# Altium schematic sheet DDR3LChip.SchDoc
size A3; SheetNumber: 6; SheetTotal: 22
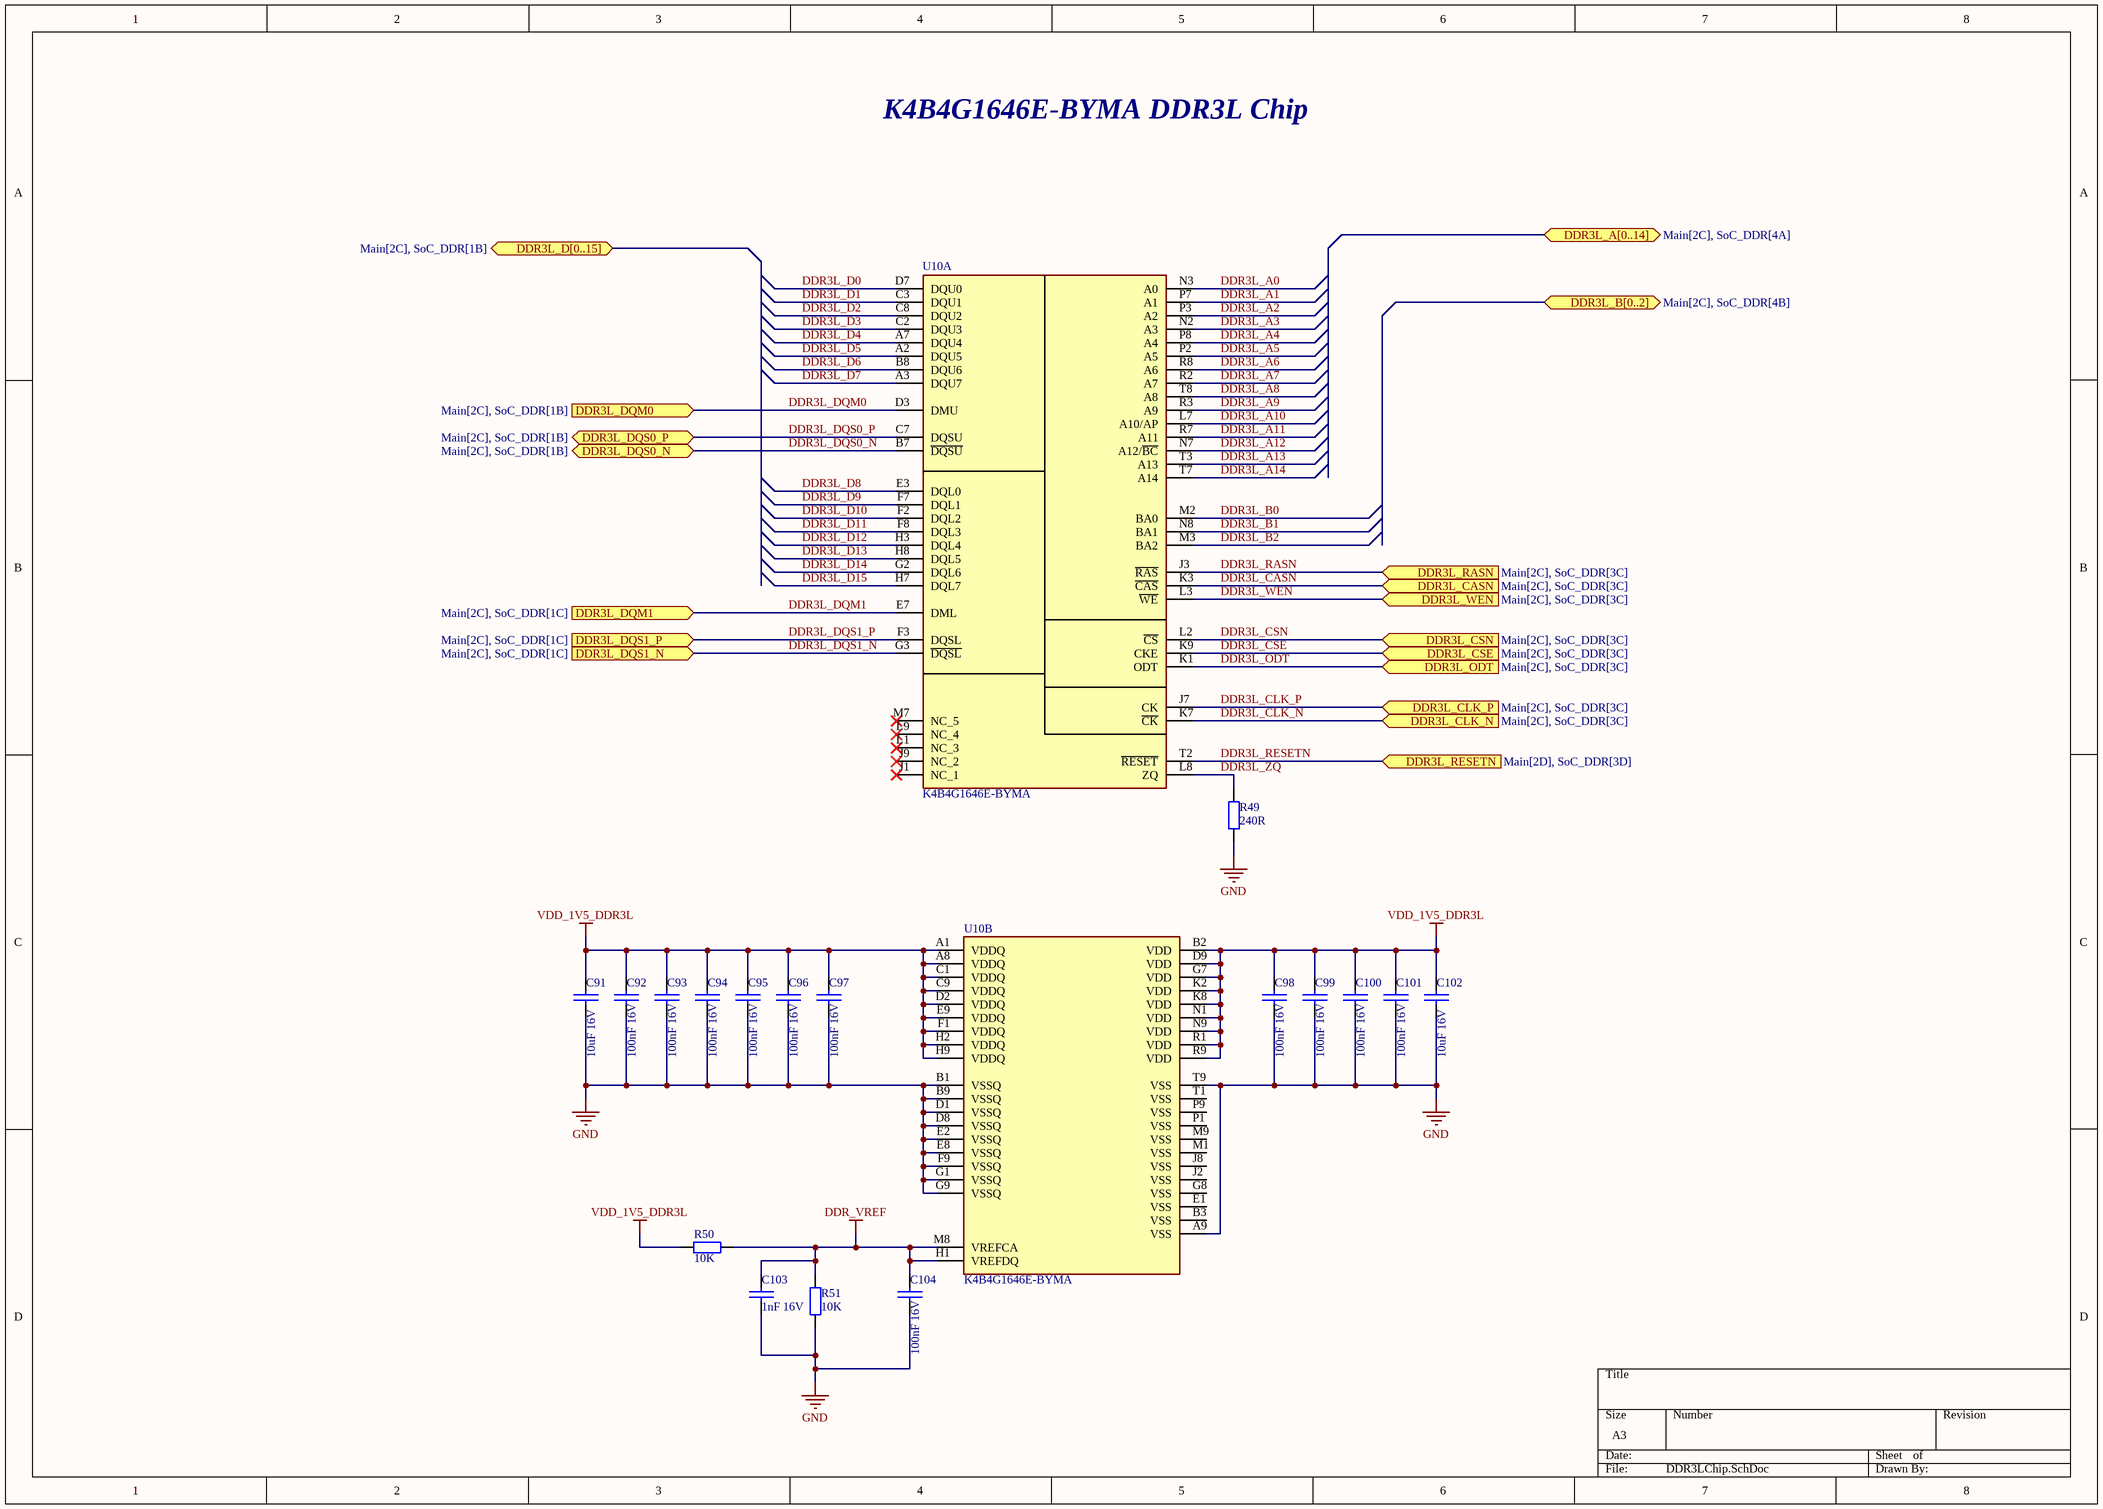
[diagram p0: DDR3LChip.SchDoc]

## Parts
C91  10uF 16V  [C_0603]
C92  100nF 16V  [C_0402]
C93  100nF 16V  [C_0402]
C94  100nF 16V  [C_0402]
C95  100nF 16V  [C_0402]
C96  100nF 16V  [C_0402]
C97  100nF 16V  [C_0402]
C98  100nF 16V  [C_0402]
C99  100nF 16V  [C_0402]
C100  100nF 16V  [C_0402]
C101  100nF 16V  [C_0402]
C102  10uF 16V  [C_0603]
C103  1nF 16V  [C_0402]
C104  100nF 16V  [C_0402]
R49  240R  [R_0402]
R50  10K  [R_0402]
R51  10K  [R_0402]
U10  K4B4G1646E-BYMA  [BGA96C80P9X16_750X1330X120]  (parts A,B of 2)

## Ports
DDR3L_A[0..14] (bidir, see Main[2C], SoC_DDR[4A]), DDR3L_B[0..2] (bidir, see Main[2C], SoC_DDR[4B]), DDR3L_CASN (in, see Main[2C], SoC_DDR[3C]), DDR3L_CLK_N (in, see Main[2C], SoC_DDR[3C]), DDR3L_CLK_P (in, see Main[2C], SoC_DDR[3C]), DDR3L_CSE (in, see Main[2C], SoC_DDR[3C]), DDR3L_CSN (in, see Main[2C], SoC_DDR[3C]), DDR3L_D[0..15] (bidir, see Main[2C], SoC_DDR[1B]), DDR3L_DQM0 (in, see Main[2C], SoC_DDR[1B]), DDR3L_DQM1 (in, see Main[2C], SoC_DDR[1C]), DDR3L_DQS0_N (bidir, see Main[2C], SoC_DDR[1B]), DDR3L_DQS0_P (bidir, see Main[2C], SoC_DDR[1B]), DDR3L_DQS1_N (in, see Main[2C], SoC_DDR[1C]), DDR3L_DQS1_P (in, see Main[2C], SoC_DDR[1C]), DDR3L_ODT (in, see Main[2C], SoC_DDR[3C]), DDR3L_RASN (in, see Main[2C], SoC_DDR[3C]), DDR3L_RESETN (in, see Main[2D], SoC_DDR[3D]), DDR3L_WEN (in, see Main[2C], SoC_DDR[3C])

## Nets
DDR_VREF: C103.1 C104.1 R50.1 R51.1 U10.H1(VREFDQ) U10.M8(VREFCA)
GND: C91.2 C92.2 C93.2 C94.2 C95.2 C96.2 C97.2 C98.2 C99.2 C100.2 C101.2 C102.2 C103.2 C104.2 R49.1 R51.2 U10.A9(VSS) U10.B1(VSSQ) U10.B9(VSSQ) U10.D1(VSSQ) U10.D8(VSSQ) U10.E2(VSSQ) U10.E8(VSSQ) U10.F9(VSSQ) U10.G1(VSSQ) U10.G9(VSSQ) U10.T9(VSS)
VDD_1V5_DDR3L: C91.1 C92.1 C93.1 C94.1 C95.1 C96.1 C97.1 C98.1 C99.1 C100.1 C101.1 C102.1 R50.2 U10.A1(VDDQ) U10.A8(VDDQ) U10.B2(VDD) U10.C1(VDDQ) U10.C9(VDDQ) U10.D2(VDDQ) U10.D9(VDD) U10.E9(VDDQ) U10.F1(VDDQ) U10.G7(VDD) U10.H2(VDDQ) U10.H9(VDDQ) U10.K2(VDD) U10.K8(VDD) U10.N1(VDD) U10.N9(VDD) U10.R1(VDD) U10.R9(VDD)
DDR3L_A0: U10.N3(A0)
DDR3L_A1: U10.P7(A1)
DDR3L_A2: U10.P3(A2)
DDR3L_A3: U10.N2(A3)
DDR3L_A4: U10.P8(A4)
DDR3L_A5: U10.P2(A5)
DDR3L_A6: U10.R8(A6)
DDR3L_A7: U10.R2(A7)
DDR3L_A8: U10.T8(A8)
DDR3L_A9: U10.R3(A9)
DDR3L_A10: U10.L7(A10/AP)
DDR3L_A11: U10.R7(A11)
DDR3L_A12: U10.N7(A12/~{BC})
DDR3L_A13: U10.T3(A13)
DDR3L_A14: U10.T7(A14)
DDR3L_B0: U10.M2(BA0)
DDR3L_B1: U10.N8(BA1)
DDR3L_B2: U10.M3(BA2)
DDR3L_CASN: U10.K3(~{CAS}) ; port DDR3L_CASN
DDR3L_CLK_N: U10.K7(~{CK}) ; port DDR3L_CLK_N
DDR3L_CLK_P: U10.J7(CK) ; port DDR3L_CLK_P
DDR3L_CSE: U10.K9(CKE) ; port DDR3L_CSE
DDR3L_CSN: U10.L2(~{CS}) ; port DDR3L_CSN
DDR3L_D0: U10.D7(DQU0)
DDR3L_D1: U10.C3(DQU1)
DDR3L_D2: U10.C8(DQU2)
DDR3L_D3: U10.C2(DQU3)
DDR3L_D4: U10.A7(DQU4)
DDR3L_D5: U10.A2(DQU5)
DDR3L_D6: U10.B8(DQU6)
DDR3L_D7: U10.A3(DQU7)
DDR3L_D8: U10.E3(DQL0)
DDR3L_D9: U10.F7(DQL1)
DDR3L_D10: U10.F2(DQL2)
DDR3L_D11: U10.F8(DQL3)
DDR3L_D12: U10.H3(DQL4)
DDR3L_D13: U10.H8(DQL5)
DDR3L_D14: U10.G2(DQL6)
DDR3L_D15: U10.H7(DQL7)
DDR3L_DQM0: U10.D3(DMU) ; port DDR3L_DQM0
DDR3L_DQM1: U10.E7(DML) ; port DDR3L_DQM1
DDR3L_DQS0_N: U10.B7(~{DQSU}) ; port DDR3L_DQS0_N
DDR3L_DQS0_P: U10.C7(DQSU) ; port DDR3L_DQS0_P
DDR3L_DQS1_N: U10.G3(~{DQSL}) ; port DDR3L_DQS1_N
DDR3L_DQS1_P: U10.F3(DQSL) ; port DDR3L_DQS1_P
DDR3L_ODT: U10.K1(ODT) ; port DDR3L_ODT
DDR3L_RASN: U10.J3(~{RAS}) ; port DDR3L_RASN
DDR3L_RESETN: U10.T2(~{RESET}) ; port DDR3L_RESETN
DDR3L_WEN: U10.L3(~{WE}) ; port DDR3L_WEN
DDR3L_ZQ: R49.2 U10.L8(ZQ)

Not connected (* = marked no-connect by the designer): U10 B3(VSS) E1(VSS) G8(VSS) J1(NC_1)* J2(VSS) J8(VSS) J9(NC_2)* L1(NC_3)* L9(NC_4)* M1(VSS) M7(NC_5)* M9(VSS) P1(VSS) P9(VSS) T1(VSS)

## Notes on the sheet
- K4B4G1646E-BYMA DDR3L Chip

## Library data of the parts
C91 C102 = C_0603: Capacitor 0603 SMD
C92-C101 C103 C104 = C_0402: Capacitor 0402 SMD
R49-R51 = R_0402: Resistor 0402 SMD
U10 = K4B4G1646E-BYMA: 4Gbit SDRAM DDR3L 933MHz FBGA-96(7.5x13.3) DDR SDRAM ROHS; Mnufacturer: Samsung; Manufacturer Part Number: K4B4G1646E-BYMA; Datasheet Link: https://download.semiconductor.samsung.com/resources/data-sheet/DS_K4B4G1646E_BY_M_Rev1_11-0.pdf